# Altium schematic sheet MAIN.SchDoc
size A4
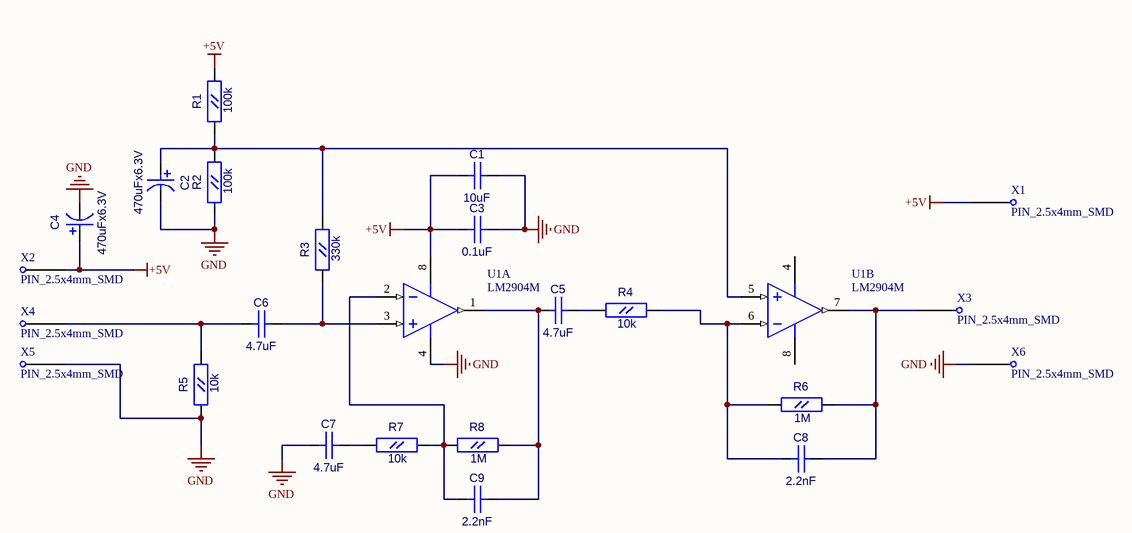
[diagram p0: MAIN.SchDoc]

## Parts
C1  10uF  [CC0805]
C2  value 470uFx6.3V  [TAJ-D-1M]  (hidden comment: TAJ-D)
C3  0.1uF  [CC0603]
C4  value 470uFx6.3V  [TAJ-D-1M]  (hidden comment: TAJ-D)
C5  4.7uF  [CC0805]
C6  4.7uF  [CC0805]
C7  4.7uF  [CC0805]
C8  2.2nF  [CC0603]
C9  2.2nF  [CC0603]
R1  100k  [RC0603]
R2  100k  [RC0603]
R3  330k  [RC0603]
R4  10k  [RC0603]
R5  10k  [RC0603]
R6  1M  [RC0603]
R7  10k  [RC0603]
R8  1M  [RC0603]
U1  LM2904M  [M08A_N]  (parts A,B of 2)
X1  PIN_2.5x4mm_SMD  [PIN_2.5x4mm_SMD]
X2  PIN_2.5x4mm_SMD  [PIN_2.5x4mm_SMD]
X3  PIN_2.5x4mm_SMD  [PIN_2.5x4mm_SMD]
X4  PIN_2.5x4mm_SMD  [PIN_2.5x4mm_SMD]
X5  PIN_2.5x4mm_SMD  [PIN_2.5x4mm_SMD]
X6  PIN_2.5x4mm_SMD  [PIN_2.5x4mm_SMD]

## Nets
+5V: C1.1(A) C3.1(A) C4.1(A) R1.2(B) U1.8(V+) X1.1 X2.1
GND: C1.2(B) C2.2(B) C3.2(B) C4.2(B) C7.1(A) R2.1(A) R5.1(A) U1.4(GND) X5.1 X6.1
NetC2_1: C2.1(A) R1.1(A) R2.2(B) R3.2(B) U1.5(INB+)
NetC5_1: C5.1(A) C9.2(B) R8.2(B) U1.1(OUTA)
NetC5_2: C5.2(B) R4.1(A)
NetC6_1: C6.1(A) R5.2(B) X4.1
NetC6_2: C6.2(B) R3.1(A) U1.3(INA+)
NetC7_2: C7.2(B) R7.1(A)
NetC8_1: C8.1(A) R4.2(B) R6.1(A) U1.6(INB-)
NetC8_2: C8.2(B) R6.2(B) U1.7(OUTB) X3.1
NetC9_1: C9.1(A) R7.2(B) R8.1(A) U1.2(INA-)

## Library data of the parts
C1 C5-C7 = CC0805
  C1: Value: 10uF
  C5-C7: Value: 4.7uF
C3 C8 C9 = CC0603
  C3: Value: 0.1uF
  C8 C9: Value: 2.2nF
R1-R8 = RC0603
  R1 R2: Value: 100k
  R3: Value: 330k
  R4 R5 R7: Value: 10k
  R6 R8: Value: 1M
U1 = LM2904M: Low Power Dual Operational Amplifier, 8-pin Narrow SOIC; Manufacturer: National Semiconductor; PackageTopMarking: NSZXTT*LM*2904M; PowerWise: N; CompType: Amplifiers; Published: 4-Dec-2008; LatestRevisionDate: 13-Jan-2009; LatestRevisionNote: Sim Model Added.; DatasheetVersion: Oct-2005; PackageVersion: revM, May-2009; PackageReference: M08A; Publisher: Altium Limited; PackageDescription: SOIC Narrow, 4.9 x 3.9 x 1.45mm, 8 Lead, 1.27mm Pitch; Supplier 1: Farnell; Supplier Part Number 1: 9486860; PartNumber: LM2904M; RoHS: N; PinCount: 8; Code_JEDEC: MS-012-AA; Code_IPC: SOIC127P600-8; ComponentLink1Description: LM2904 Datasheet; ComponentLink1URL: http://www.national.com/ds/LM/LM2904.pdf; ComponentLink2Description: LM2904 Web Page; ComponentLink2URL: http://www.national.com/pf/LM/LM2904.html; ComponentLink3Description: M08A Package Page; ComponentLink3URL: http://www.national.com/packaging/folders/m08a.html